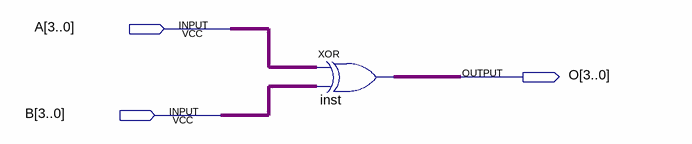
[diagram p0: schematic sheet]
// Quartus schematic xor_logic.bdf as structural Verilog: 1 symbols, 3 pins
module xor_logic (
  input  [3:0] A,
  input  [3:0] B,
  output [3:0] O
);

  assign O = A ^ B;  // XOR inst, 4 bits wide
endmodule
